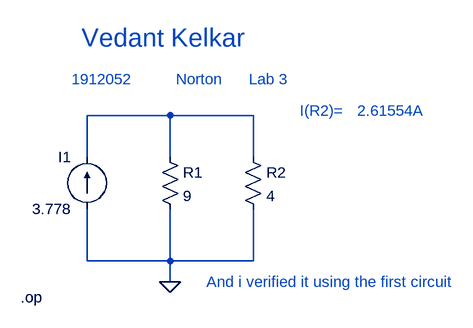
[diagram p0: schematic Draft9.asc]
Draft9.asc, the LTspice schematic file:
Version 4
SHEET 1 880 680
WIRE 224 -48 96 -48
WIRE 352 -48 224 -48
WIRE 96 16 96 -48
WIRE 224 16 224 -48
WIRE 352 16 352 -48
WIRE 96 176 96 96
WIRE 224 176 224 96
WIRE 224 176 96 176
WIRE 352 176 352 96
WIRE 352 176 224 176
WIRE 224 208 224 176
FLAG 224 208 0
SYMBOL current 96 96 R180
WINDOW 0 24 80 Left 2
WINDOW 3 24 0 Left 2
WINDOW 123 0 0 Left 0
WINDOW 39 0 0 Left 0
SYMATTR InstName I1
SYMATTR Value 3.778
SYMBOL res 208 0 R0
SYMATTR InstName R1
SYMATTR Value 9
SYMBOL res 336 0 R0
SYMATTR InstName R2
SYMATTR Value 4
TEXT -6 232 Left 2 !.op
TEXT 88 -168 Left 4 ;Vedant Kelkar
TEXT 72 -104 Left 2 ;1912052          Norton      Lab 3
TEXT 424 -56 Left 2 ;I(R2)=
TEXT 280 208 Left 2 ;And i verified it using the first circuit
TEXT 512 -56 Left 2 ;2.61554A

The netlist it stands for:
* Draft9.asc
I1 0 N001 3.778
R1 N001 0 9
R2 N001 0 4
.op
* Vedant Kelkar
* 1912052          Norton      Lab 3
* I(R2)=
* And i verified it using the first circuit
* 2.61554A
.backanno
.end